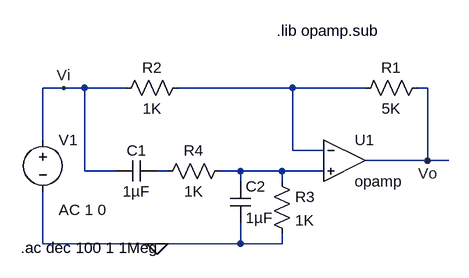
[diagram p0: schematic tp1-7-2.asc]
tp1-7-2.asc, the LTspice schematic file:
Version 4
SHEET 1 880 680
WIRE -208 32 -240 32
WIRE -176 32 -208 32
WIRE -112 32 -176 32
WIRE 144 32 -32 32
WIRE 256 32 144 32
WIRE 352 32 336 32
WIRE -240 112 -240 32
WIRE 144 128 144 32
WIRE 192 128 144 128
WIRE 352 144 352 32
WIRE 352 144 256 144
WIRE 384 144 352 144
WIRE -176 160 -176 32
WIRE -128 160 -176 160
WIRE -48 160 -64 160
WIRE 64 160 32 160
WIRE 128 160 64 160
WIRE 192 160 128 160
WIRE 64 176 64 160
WIRE 128 176 128 160
WIRE -240 272 -240 192
WIRE -64 272 -240 272
WIRE 64 272 64 240
WIRE 64 272 -64 272
WIRE 128 272 128 256
WIRE 128 272 64 272
FLAG 352 144 Vo
FLAG -208 32 Vi
FLAG -64 272 0
SYMBOL OpAmps\\opamp 224 80 R0
SYMATTR InstName U1
SYMBOL res 352 16 R90
WINDOW 0 0 56 VBottom 2
WINDOW 3 32 56 VTop 2
SYMATTR InstName R1
SYMATTR Value 5K
SYMBOL res -16 16 R90
WINDOW 0 0 56 VBottom 2
WINDOW 3 32 56 VTop 2
SYMATTR InstName R2
SYMATTR Value 1K
SYMBOL res 112 160 R0
SYMATTR InstName R3
SYMATTR Value 1K
SYMBOL cap -64 144 R90
WINDOW 0 0 32 VBottom 2
WINDOW 3 32 32 VTop 2
SYMATTR InstName C1
SYMATTR Value 1µF
SYMBOL voltage -240 96 R0
WINDOW 123 24 124 Left 2
WINDOW 39 0 0 Left 0
SYMATTR InstName V1
SYMATTR Value ""
SYMATTR Value2 AC 1 0
SYMBOL res 48 144 R90
WINDOW 0 0 56 VBottom 2
WINDOW 3 32 56 VTop 2
SYMATTR InstName R4
SYMATTR Value 1K
SYMBOL cap 48 176 R0
SYMATTR InstName C2
SYMATTR Value 1µF
TEXT 120 -56 Left 2 !.lib opamp.sub
TEXT -274 278 Left 2 !.ac dec 100 1 1Meg

The netlist it stands for:
* tp1-7-2.asc
XU1 N001 N003 Vo opamp Aol=100K GBW=10Meg  ; pins invin noninvin out
R1 Vo N001 5K
R2 N001 Vi 1K
R3 N003 0 1K
C1 N002 Vi 1µF
V1 Vi 0 AC 1 0
R4 N003 N002 1K
C2 N003 0 1µF
.lib opamp.sub
.ac dec 100 1 1Meg
.backanno
.end